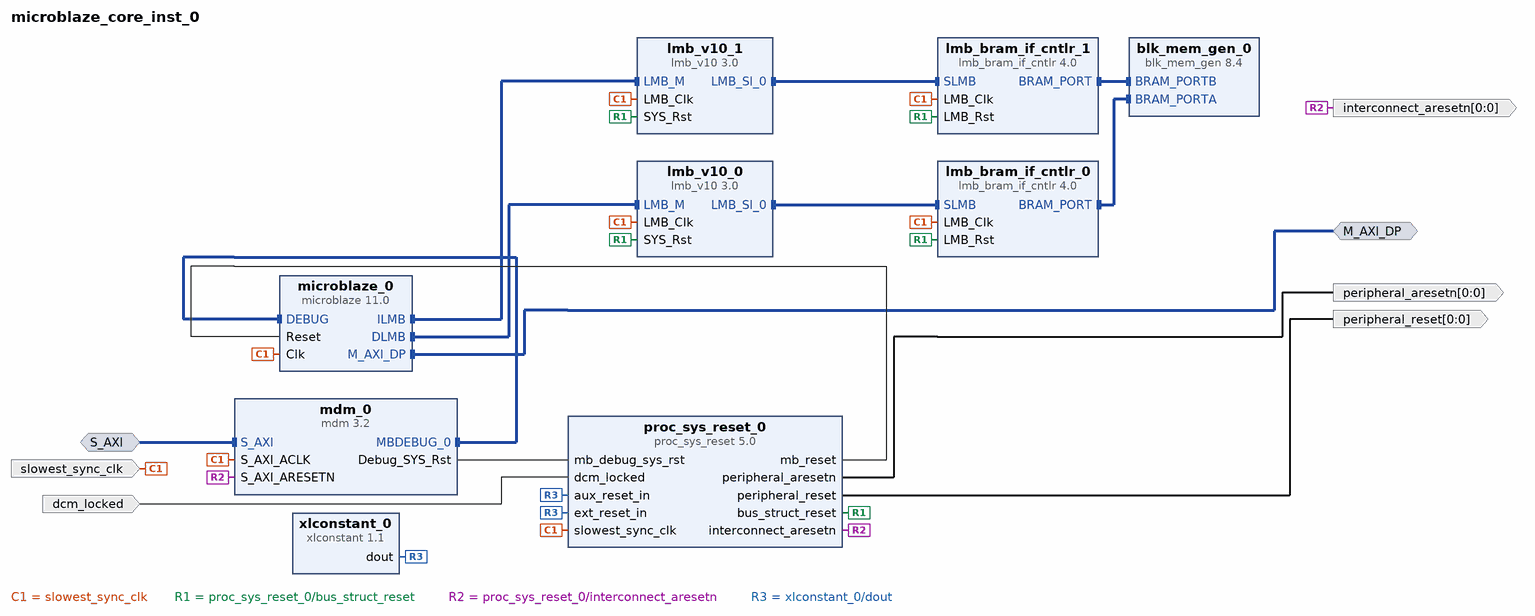
[diagram p0: block diagram of the top level]
# Vivado block design microblaze_core_inst_0, xc7k325tffg676-2, Vivado 2024.2
create_bd_design microblaze_core_inst_0

create_bd_intf_port -mode Master -vlnv xilinx.com:interface:aximm_rtl:1.0 M_AXI_DP
create_bd_intf_port -mode Slave -vlnv xilinx.com:interface:aximm_rtl:1.0 S_AXI
create_bd_port -dir I dcm_locked
create_bd_port -dir O -from 0 -to 0 -type rst interconnect_aresetn
create_bd_port -dir O -from 0 -to 0 -type rst peripheral_aresetn
create_bd_port -dir O -from 0 -to 0 -type rst peripheral_reset
create_bd_port -dir I -type clk slowest_sync_clk

create_bd_cell -type ip -vlnv xilinx.com:ip:blk_mem_gen:8.4 blk_mem_gen_0
set_property -dict [list \
  CONFIG.EN_SAFETY_CKT false \
  CONFIG.Enable_B Use_ENB_Pin \
  CONFIG.Memory_Type True_Dual_Port_RAM \
  CONFIG.Port_B_Clock 100 \
  CONFIG.Port_B_Enable_Rate 100 \
  CONFIG.Port_B_Write_Rate 50 \
  CONFIG.Use_RSTB_Pin true \
] [get_bd_cells blk_mem_gen_0]
create_bd_cell -type ip -vlnv xilinx.com:ip:lmb_bram_if_cntlr:4.0 lmb_bram_if_cntlr_0
create_bd_cell -type ip -vlnv xilinx.com:ip:lmb_bram_if_cntlr:4.0 lmb_bram_if_cntlr_1
create_bd_cell -type ip -vlnv xilinx.com:ip:lmb_v10:3.0 lmb_v10_0
create_bd_cell -type ip -vlnv xilinx.com:ip:lmb_v10:3.0 lmb_v10_1
create_bd_cell -type ip -vlnv xilinx.com:ip:mdm:3.2 mdm_0
set_property -dict {CONFIG.C_ADDR_SIZE 32 CONFIG.C_M_AXI_ADDR_WIDTH 32 CONFIG.C_USE_UART 1} [get_bd_cells mdm_0]
create_bd_cell -type ip -vlnv xilinx.com:ip:microblaze:11.0 microblaze_0
set_property -dict [list \
  CONFIG.C_D_AXI 1 \
  CONFIG.C_D_LMB 1 \
  CONFIG.C_FAULT_TOLERANT 1 \
  CONFIG.C_FSL_LINKS 0 \
  CONFIG.C_I_LMB 1 \
  CONFIG.C_NUMBER_OF_PC_BRK 8 \
  CONFIG.C_NUMBER_OF_RD_ADDR_BRK 1 \
  CONFIG.C_NUMBER_OF_WR_ADDR_BRK 1 \
  CONFIG.C_USE_DIV 1 \
  CONFIG.C_USE_FPU 1 \
  CONFIG.C_USE_HW_MUL 1 \
  CONFIG.C_USE_MSR_INSTR 1 \
  CONFIG.C_USE_PCMP_INSTR 1 \
] [get_bd_cells microblaze_0]
create_bd_cell -type ip -vlnv xilinx.com:ip:proc_sys_reset:5.0 proc_sys_reset_0
create_bd_cell -type ip -vlnv xilinx.com:ip:xlconstant:1.1 xlconstant_0
set_property -dict {CONFIG.CONST_VAL 1} [get_bd_cells xlconstant_0]

# ---- connections ----

connect_bd_intf_net [get_bd_intf_pins lmb_v10_0/LMB_Sl_0] [get_bd_intf_pins lmb_bram_if_cntlr_0/SLMB]
connect_bd_intf_net [get_bd_intf_pins lmb_v10_1/LMB_Sl_0] [get_bd_intf_pins lmb_bram_if_cntlr_1/SLMB]
connect_bd_intf_net [get_bd_intf_pins mdm_0/S_AXI] [get_bd_intf_ports S_AXI]
connect_bd_intf_net [get_bd_intf_pins lmb_bram_if_cntlr_0/BRAM_PORT] [get_bd_intf_pins blk_mem_gen_0/BRAM_PORTA]
connect_bd_intf_net [get_bd_intf_pins lmb_bram_if_cntlr_1/BRAM_PORT] [get_bd_intf_pins blk_mem_gen_0/BRAM_PORTB]
connect_bd_intf_net [get_bd_intf_pins mdm_0/MBDEBUG_0] [get_bd_intf_pins microblaze_0/DEBUG]
connect_bd_intf_net [get_bd_intf_pins microblaze_0/DLMB] [get_bd_intf_pins lmb_v10_0/LMB_M]
connect_bd_intf_net [get_bd_intf_pins microblaze_0/ILMB] [get_bd_intf_pins lmb_v10_1/LMB_M]
connect_bd_intf_net [get_bd_intf_ports M_AXI_DP] [get_bd_intf_pins microblaze_0/M_AXI_DP]
connect_bd_net -net clk_wiz_0_clk_out1 [get_bd_ports slowest_sync_clk] \
  [get_bd_pins lmb_bram_if_cntlr_0/LMB_Clk] [get_bd_pins lmb_bram_if_cntlr_1/LMB_Clk] [get_bd_pins lmb_v10_0/LMB_Clk] \
  [get_bd_pins lmb_v10_1/LMB_Clk] [get_bd_pins mdm_0/S_AXI_ACLK] [get_bd_pins microblaze_0/Clk] \
  [get_bd_pins proc_sys_reset_0/slowest_sync_clk]
connect_bd_net -net clk_wiz_0_locked [get_bd_ports dcm_locked] [get_bd_pins proc_sys_reset_0/dcm_locked]
connect_bd_net [get_bd_pins mdm_0/Debug_SYS_Rst] [get_bd_pins proc_sys_reset_0/mb_debug_sys_rst]
connect_bd_net [get_bd_pins proc_sys_reset_0/bus_struct_reset] \
  [get_bd_pins lmb_bram_if_cntlr_0/LMB_Rst] [get_bd_pins lmb_bram_if_cntlr_1/LMB_Rst] [get_bd_pins lmb_v10_0/SYS_Rst] \
  [get_bd_pins lmb_v10_1/SYS_Rst]
connect_bd_net [get_bd_pins proc_sys_reset_0/interconnect_aresetn] [get_bd_ports interconnect_aresetn] [get_bd_pins mdm_0/S_AXI_ARESETN]
connect_bd_net [get_bd_pins proc_sys_reset_0/mb_reset] [get_bd_pins microblaze_0/Reset]
connect_bd_net [get_bd_pins proc_sys_reset_0/peripheral_aresetn] [get_bd_ports peripheral_aresetn]
connect_bd_net [get_bd_pins proc_sys_reset_0/peripheral_reset] [get_bd_ports peripheral_reset]
connect_bd_net [get_bd_pins xlconstant_0/dout] [get_bd_pins proc_sys_reset_0/ext_reset_in] [get_bd_pins proc_sys_reset_0/aux_reset_in]
set_property HDL_ATTRIBUTE.BMM_INFO_ADDRESS_SPACE {byte  0x80000000 32 > microblaze_core_inst_0 blk_mem_gen_0} [get_bd_cells lmb_bram_if_cntlr_0]
set_property HDL_ATTRIBUTE.KEEP_HIERARCHY yes [get_bd_cells lmb_bram_if_cntlr_0]
set_property HDL_ATTRIBUTE.BMM_INFO_PROCESSOR {microblaze-le > microblaze_core_inst_0 lmb_bram_if_cntlr_0} [get_bd_cells microblaze_0]
set_property HDL_ATTRIBUTE.KEEP_HIERARCHY yes [get_bd_cells microblaze_0]

# ---- address map ----
assign_bd_address -offset 0x00000000 -range 256M -target_address_space [get_bd_addr_spaces microblaze_0/Data] [get_bd_addr_segs M_AXI_DP/:mig_7series_0:memmap:memaddr]
assign_bd_address -offset 0x40600000 -range 64K -target_address_space [get_bd_addr_spaces microblaze_0/Data] [get_bd_addr_segs M_AXI_DP/:axi_uartlite_0:S_AXI:Reg]
assign_bd_address -offset 0x41400000 -range 4K -target_address_space [get_bd_addr_spaces microblaze_0/Data] [get_bd_addr_segs M_AXI_DP/:microblaze_core_0:mdm_0:S_AXI:Reg]
assign_bd_address -offset 0x80000000 -range 256K -target_address_space [get_bd_addr_spaces microblaze_0/Data] [get_bd_addr_segs lmb_bram_if_cntlr_0/SLMB/Mem]
assign_bd_address -offset 0x80000000 -range 256K -target_address_space [get_bd_addr_spaces microblaze_0/Instruction] [get_bd_addr_segs lmb_bram_if_cntlr_1/SLMB/Mem]
assign_bd_address -offset 0x41400000 -range 4K -target_address_space [get_bd_addr_spaces S_AXI] [get_bd_addr_segs mdm_0/S_AXI/Reg]
assign_bd_address -offset 0x41400000 -range 4K -target_address_space [get_bd_addr_spaces S_AXI] [get_bd_addr_segs mdm_0/S_AXI/Reg]

validate_bd_design
save_bd_design
